# Altium schematic sheet PAGE2.SchDoc
size 297 x 209 mm
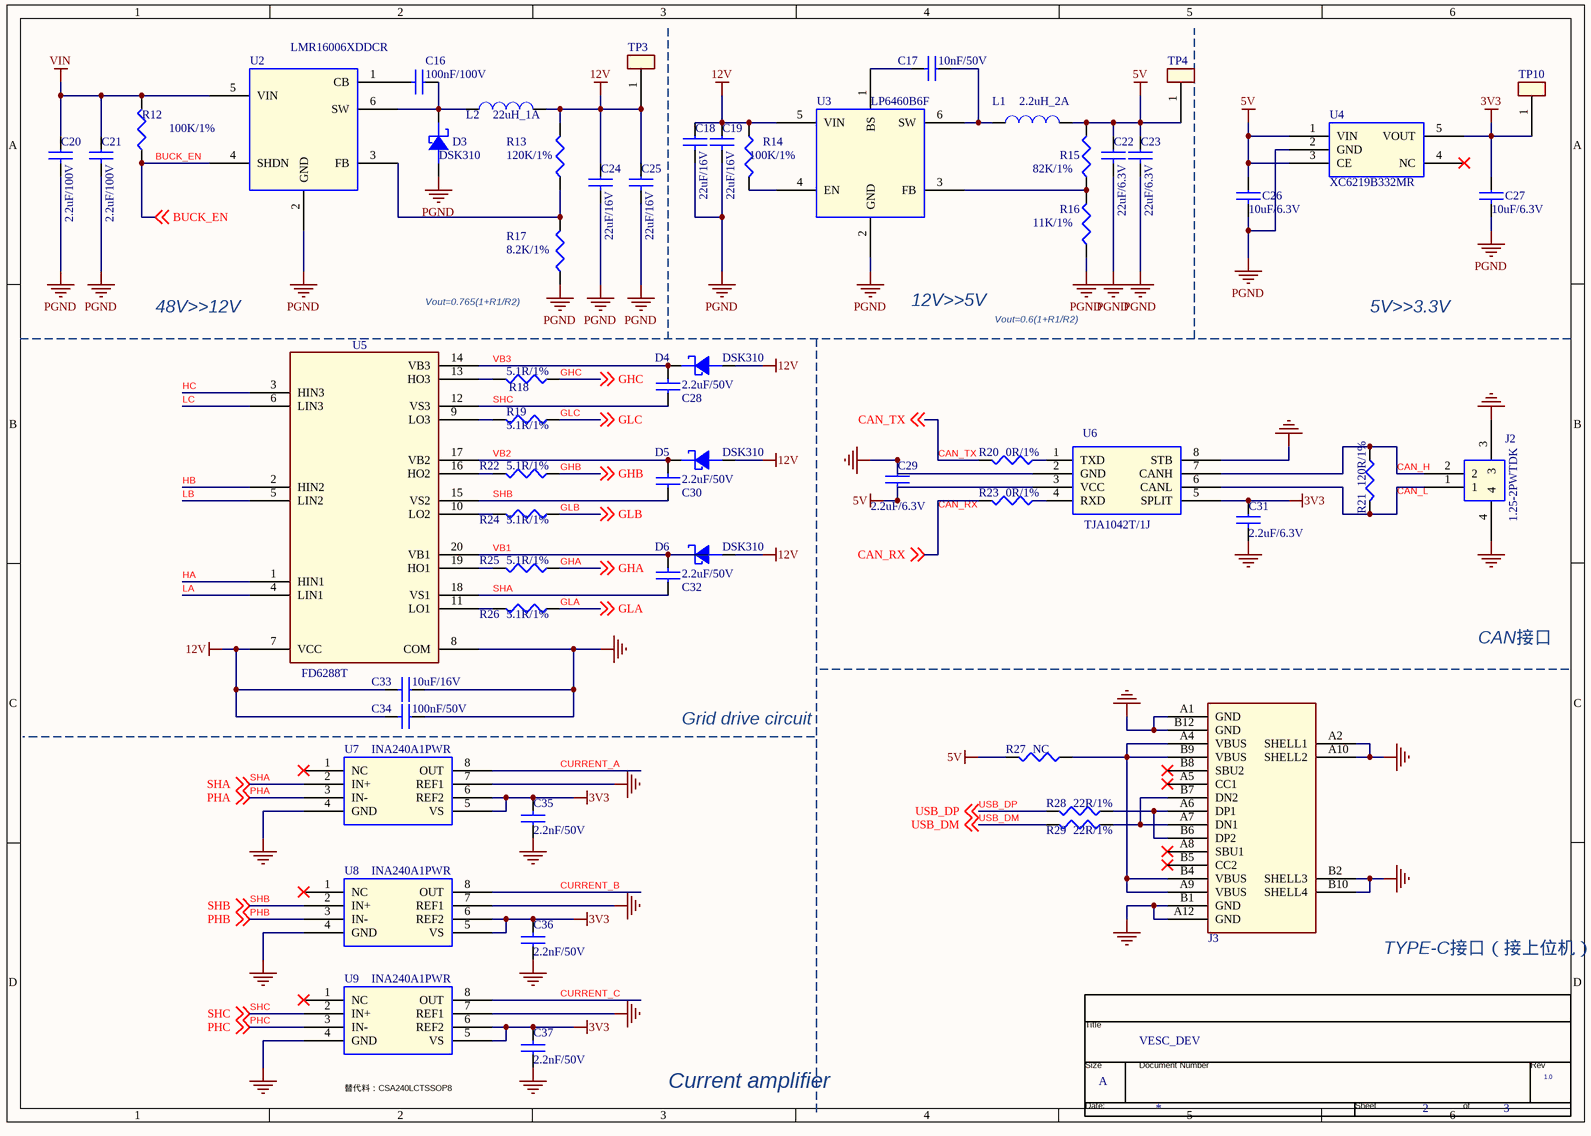
[diagram p0: PAGE2.SchDoc]

## Parts
*  Page Count: 3  Page Number: 2  Page Size: A  Title: VESC_DEV  RevCode: 1.0  (hidden comment: TitleBlock0)  (graphical)
C16  100nF/100V  [C0603]
C17  10nF/50V  [C0402]
C18  22uF/16V  [C0805]
C19  22uF/16V  [C0805]
C20  2.2uF/100V  [C1206]
C21  2.2uF/100V  [C1206]
C22  22uF/6.3V  [C0805]
C23  22uF/6.3V  [C0805]
C24  22uF/16V  [C0805]
C25  22uF/16V  [C0805]
C26  10uF/6.3V  [C0402]
C27  10uF/6.3V  [C0402]
C28  2.2uF/50V  [C0603]
C29  2.2uF/6.3V  [C0402]
C30  2.2uF/50V  [C0603]
C31  2.2uF/6.3V  [C0402]
C32  2.2uF/50V  [C0603]
C33  10uF/16V  [C0603]
C34  100nF/50V  [C0402]
C35  2.2nF/50V  [C0402]
C36  2.2nF/50V  [C0402]
C37  2.2nF/50V  [C0402]
D3  DSK310  [SOD-123F]
D4  DSK310  [SOD-123F]
D5  DSK310  [SOD-123F]
D6  DSK310  [SOD-123F]
J2  1.25-2PWTDK  [SMD-2P-1_25]
J3  TYPE-C 16PLC-H10.0  [TYPE-C-TH_16PLC-H10.0]  (value not drawn)
L1  2.2uH_2A  [L4020]
L2  22uH_1A  [L4020]
R12  100K/1%  [R0402]
R13  120K/1%  [R0402]
R14  100K/1%  [R0402]
R15  82K/1%  [R0402]
R16  11K/1%  [R0402]
R17  8.2K/1%  [R0402]
R18  5.1R/1%  [R0402]
R19  5.1R/1%  [R0402]
R20  0R/1%  [R0402]
R21  120R/1%  [R0402]
R22  5.1R/1%  [R0402]
R23  0R/1%  [R0402]
R24  5.1R/1%  [R0402]
R25  5.1R/1%  [R0402]
R26  5.1R/1%  [R0402]
R27  NC  [R0603]
R28  22R/1%  [R0402]
R29  22R/1%  [R0402]
TP3  TEST POINT  [test_point_100_smd]  (value not drawn)
TP4  TEST POINT  [test_point_100_smd]  (value not drawn)
TP10  TEST POINT  [test_point_100_smd]  (value not drawn)
U2  LMR16006XDDCR  [SOT-23-6]
U3  LP6460B6F  [SOT-23-6]
U4  XC6219B332MR  [SOT-23-5]
U5  FD6288T  [TSSOP-20]
U6  TJA1042T/1J  [SOP-8]
U7  INA240A1PWR  [TSSOP-8]
U8  INA240A1PWR  [TSSOP-8]
U9  INA240A1PWR  [TSSOP-8]

## Nets
3V3: C27.1 C31.1 C35.2 C36.2 C37.2 TP10.1 U4.5(VOUT) U6.5(SPLIT) U7.5(VS) U7.6(REF2) U8.5(VS) U8.6(REF2) U9.5(VS) U9.6(REF2)
5V: C22.1 C23.1 C26.1 C29.2 L1.2 R15.2 R27.2 TP4.1 U4.1(VIN) U4.3(CE) U6.3(VCC)
12V: C18.1 C19.1 C24.1 C25.1 C33.2 C34.2 D4.2(A) D5.2(A) D6.2(A) L2.2 R13.2 R14.1 TP3.1 U3.5(VIN) U5.7(VCC)
GND: C29.1 C31.2 C33.1 C34.1 C35.1 C36.1 C37.1 J2.3 J2.4 J3.A1(GND) J3.A2(SHELL1) J3.A10(SHELL2) J3.A12(GND) J3.B1(GND) J3.B2(SHELL3) J3.B10(SHELL4) J3.B12(GND) U5.8(COM) U6.2(GND) U6.8(STB) U7.4(GND) U7.7(REF1) U8.4(GND) U8.7(REF1) U9.4(GND) U9.7(REF1)
PGND: C18.2 C19.2 C20.2 C21.2 C22.2 C23.2 C24.2 C25.2 C26.2 C27.2 D3.2(A) R16.1 R17.1 U2.2(GND) U3.2(GND) U4.2(GND)
VIN: C20.1 C21.1 R12.2 U2.5(VIN)
BUCK_EN: R12.1 U2.4(SHDN) ; off-sheet BUCK_EN
CAN_H: J2.2 R21.1 U6.7(CANH)
CAN_L: J2.1 R21.2 U6.6(CANL)
CAN_RX: R23.2 ; off-sheet CAN_RX
CAN_TX: R20.2 ; off-sheet CAN_TX
CURRENT_A: U7.8(OUT)
CURRENT_B: U8.8(OUT)
CURRENT_C: U9.8(OUT)
GHA: R25.1 ; off-sheet GHA
GHB: R22.1 ; off-sheet GHB
GHC: R18.1 ; off-sheet GHC
GLA: R26.1 ; off-sheet GLA
GLB: R24.1 ; off-sheet GLB
GLC: R19.1 ; off-sheet GLC
HA: U5.1(HIN1)
HB: U5.2(HIN2)
HC: U5.3(HIN3)
LA: U5.4(LIN1)
LB: U5.5(LIN2)
LC: U5.6(LIN3)
PHA: U7.3(IN-) ; off-sheet PHA
PHB: U8.3(IN-) ; off-sheet PHB
PHC: U9.3(IN-) ; off-sheet PHC
SHA: C32.1 U5.18(VS1) U7.2(IN+) ; off-sheet SHA
SHB: C30.1 U5.15(VS2) U8.2(IN+) ; off-sheet SHB
SHC: C28.1 U5.12(VS3) U9.2(IN+) ; off-sheet SHC
USB_DM: R29.2 ; off-sheet USB_DM
USB_DP: R28.2 ; off-sheet USB_DP
VB1: C32.2 D6.1(K) U5.20(VB1)
VB2: C30.2 D5.1(K) U5.17(VB2)
VB3: C28.2 D4.1(K) U5.14(VB3)
NetC16_1: C16.1 D3.1(K) L2.1 U2.6(SW)
NetC16_2: C16.2 U2.1(CB)
NetC17_1: C17.1 L1.1 U3.6(SW)
NetC17_2: C17.2 U3.1(BS)
NetJ3_A4: J3.A4(VBUS) J3.A9(VBUS) J3.B4(VBUS) J3.B9(VBUS) R27.1
NetJ3_A6: J3.A6(DP1) J3.B6(DP2) R28.1
NetJ3_A7: J3.A7(DN1) J3.B7(DN2) R29.1
NetR13_1: R13.1 R17.2 U2.3(FB)
NetR14_2: R14.2 U3.4(EN)
NetR15_1: R15.1 R16.2 U3.3(FB)
NetR18_2: R18.2 U5.13(HO3)
NetR19_2: R19.2 U5.9(LO3)
NetR20_1: R20.1 U6.1(TXD)
NetR22_2: R22.2 U5.16(HO2)
NetR23_1: R23.1 U6.4(RXD)
NetR24_2: R24.2 U5.10(LO2)
NetR25_2: R25.2 U5.19(HO1)
NetR26_2: R26.2 U5.11(LO1)

Not connected (* = marked no-connect by the designer): J3 A5(CC1)* A8(SBU1)* B5(CC2)* B8(SBU2)*; U4 4(NC)*; U7 1(NC)*; U8 1(NC)*; U9 1(NC)*

## Notes on the sheet
- 48V>>12V
- Vout=0.765(1+R1/R2)
- 12V>>5V
- Vout=0.6(1+R1/R2)
- 5V>>3.3V
- CAN接口
- Grid drive circuit
- TYPE-C接口（接上位机）
- (near U9) 替代料：CSA240LCTSSOP8
- Current amplifier
- (in symbol TitleBlock0) Title; Size; Document Number; Rev; Date:; Sheet; of

## Library data of the parts
C16-C37 = CAP NP
  C16 C28 C30 C32 C33: PCB Footprint: C0603
  C17 C26 C27 C29 C31 C34-C37: PCB Footprint: C0402
  C18 C19 C22-C25: PCB Footprint: C0805
  C20 C21: PCB Footprint: C1206
D3-D6 = DIODE SCHOTTKY21: PCB Footprint: SOD-123F
J3 = TYPE-C 16PLC-H10.0: 连接器类型:Type-C;标准:USB 3.1;公母:母;安装方式:直插;触点数量:16P;端口数量:1;额定电流 - 电源:5A;触头材质:-;触头镀层:-;工作温度范围:-40℃~+85℃;; Manufacturer: SHOU HAN(首韩); Add into BOM: yes; Gender: 母; Number of Contacts: 16P; Number of Ports: 1; Current Rating - Power (Max): 5A; Rated Voltage (Max): 20V; Connect-Disconnect Life: 1万次; Core Colour: 黑色; Symbol: TYPE-C 16PLC-H10.0; Device: TYPE-C 16PLC-H10.0; LCSC Part Name: Type-C 母 直插; Supplier Part: C3151747; Manufacturer Part: TYPE-C 16PLC-H10.0; Supplier Footprint: 插件; Datasheet: https://atta.szlcsc.com/upload/public/pdf/source/20240529/CC9428849977884A813B584EA396EFE9.pdf; Supplier: LCSC; Convert to PCB: yes; Connector Type: Type-C; Standard: USB 3.1; Mounting Style: 直插; Contact Material: -; Contact Plating: -; Operating Temperature Range: -40℃~+85℃
L1 L2 = INDUCTOR: PCB Footprint: L4020
R12-R29 = RESISTOR
  R12-R26 R28 R29: PCB Footprint: R0402
  R27: PCB Footprint: R0603
* = TitleBlock0: Page Create Date: March  8, 1995; Page Modify Date: *
J2 = 1.25-2PWTDK: PCB Footprint: SMD-2P-1_25
U2 = LMR16006XDDCR: PCB Footprint: SOT-23-6
U3 = LP6460B6F: PCB Footprint: SOT-23-6
U4 = XC6219B332MR: PCB Footprint: SOT-23-5
U6 = TJA1042T/1J: PCB Footprint: SOP-8
U7-U9 = INA240A1PWR: PCB Footprint: TSSOP-8